# EAGLE schematic TT_PulseGen_V1.0 (EAGLE 7.6.0)
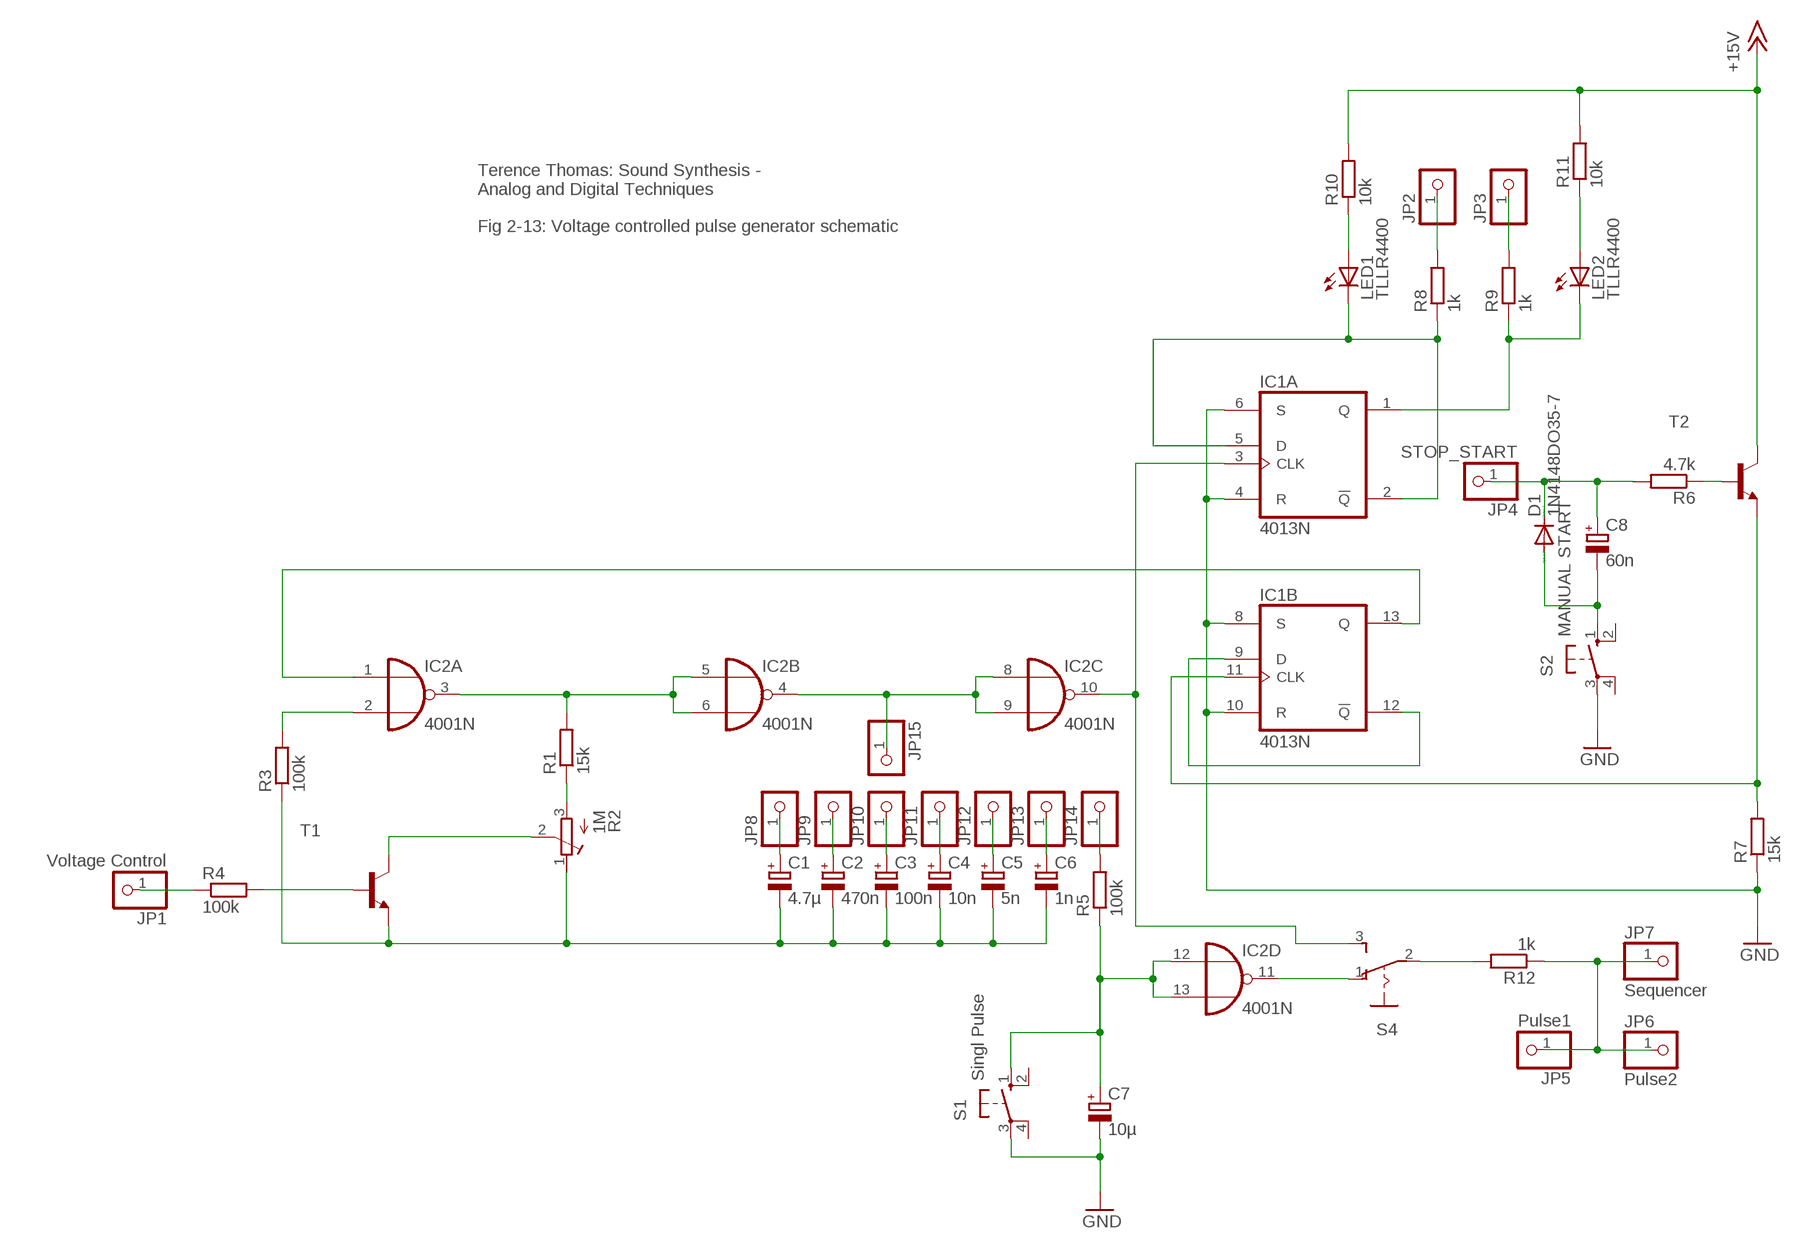
[diagram p0: schematic, sheet 1]

## Parts
C1  4.7µ  CPOL-EUE2.5-5  [E2,5-5]
C2  470n  CPOL-EUE2.5-5  [E2,5-5]
C3  100n  CPOL-EUE2.5-5  [E2,5-5]
C4  10n  CPOL-EUE2.5-5  [E2,5-5]
C5  5n  CPOL-EUE2.5-5  [E2,5-5]
C6  1n  CPOL-EUE2.5-5  [E2,5-5]
C7  10µ  CPOL-EUE2.5-5  [E2,5-5]
C8  60n  CPOL-EUE2.5-5  [E2,5-5]
D1  1N4148DO35-7  [DO35-7]
IC1  4013N  [DIL14]
IC2  4001N  [DIL14]
JP1  Voltage Control  PINHD-1X1  [1X01]
JP2  PINHD-1X1  [1X01]
JP3  PINHD-1X1  [1X01]
JP4  STOP_START  PINHD-1X1  [1X01]
JP5  Pulse1  PINHD-1X1  [1X01]
JP6  Pulse2  PINHD-1X1  [1X01]
JP7  Sequencer  PINHD-1X1  [1X01]
JP8  PINHD-1X1  [1X01]
JP9  PINHD-1X1  [1X01]
JP10  PINHD-1X1  [1X01]
JP11  PINHD-1X1  [1X01]
JP12  PINHD-1X1  [1X01]
JP13  PINHD-1X1  [1X01]
JP14  PINHD-1X1  [1X01]
JP15  PINHD-1X1  [1X01]
LED1  TLLR4400  [LED3MM]
LED2  TLLR4400  [LED3MM]
R1  15k  R-EU_0204/7  [0204/7]
R2  1M  R-TRIMMT93YA  [RTRIMT93YA]
R3  100k  R-EU_0204/7  [0204/7]
R4  100k  R-EU_0204/7  [0204/7]
R5  100k  R-EU_0204/7  [0204/7]
R6  4.7k  R-EU_0204/7  [0204/7]
R7  15k  R-EU_0204/7  [0204/7]
R8  1k  R-EU_0204/7  [0204/7]
R9  1k  R-EU_0204/7  [0204/7]
R10  10k  R-EU_0204/7  [0204/7]
R11  10k  R-EU_0204/7  [0204/7]
R12  1k  R-EU_0204/7  [0204/7]
S1  Singl Pulse  10-XX  [B3F-10XX]
S2  MANUAL START  10-XX  [B3F-10XX]
S4  255SB  [255SB]
T1  -NPN-TO92-EBC  [TO92-EBC]
T2  -NPN-TO92-EBC  [TO92-EBC]

## Nets
+15V: R10.2 R11.2 T2.C
GND: C7.- IC1.4(A:R) IC1.6(A:S) IC1.8(B:S) IC1.10(B:R) R7.1 S1.3(P) S2.3(P)
N$1: IC2.3(A:O) IC2.5(B:I0) IC2.6(B:I1) R1.2
N$2: IC2.4(B:O) IC2.8(C:I0) IC2.9(C:I1) JP15.1
N$3: C7.+ IC2.12(D:I0) IC2.13(D:I1) R5.1 S1.1(S)
N$4: R1.1 R2.3(A)
N$5: R2.2(S) T1.C
N$6: R4.2 T1.B
N$7: IC2.2(A:I1) R3.2
N$8: C1.- C2.- C3.- C4.- C5.- C6.- R2.1(E) R3.1 T1.E
N$9: IC1.13(B:Q) IC2.1(A:I0)
N$10: JP2.1 R8.2
N$11: JP1.1 R4.1
N$12: IC1.3(A:CLK) IC2.10(C:O) S4.3(S)
N$14: R6.1 T2.B
N$15: C8.+ D1.C JP4.1 R6.2
N$16: C8.- D1.A S2.1(S)
N$17: JP3.1 R9.2
N$18: IC1.9(B:D) IC1.12(B:!Q)
N$19: IC2.11(D:O) S4.1(O)
N$20: LED2.A R11.1
N$21: IC1.1(A:Q) LED2.K(C) R9.1
N$22: IC1.2(A:!Q) IC1.5(A:D) LED1.K(C) R8.1
N$23: LED1.A R10.1
N$24: R12.2 S4.2(P)
N$25: JP5.1 JP6.1 JP7.1 R12.1
N$26: C1.+ JP8.1
N$27: C2.+ JP9.1
N$28: C3.+ JP10.1
N$29: C4.+ JP11.1
N$30: C5.+ JP12.1
N$31: C6.+ JP13.1
N$32: JP14.1 R5.2
N$33: IC1.11(B:CLK) R7.2 T2.E
Unconnected: S1.2(S1) S1.4(P1) S2.2(S1) S2.4(P1)

## Notes on the sheet
- Terence Thomas: Sound Synthesis -
  Analog and Digital Techniques
  
  Fig 2-13: Voltage controlled pulse generator schematic

## Power pins joined to a net without a drawn wire
VDD: IC1.14(P:VDD) IC2.14(P:VDD)
VSS: IC1.7(P:VSS) IC2.7(P:VSS)

## Library data of the parts
C1-C8 = resistor:CPOL-EU: POLARIZED CAPACITOR, European symbol
D1 = diode:1N4148: DIODE high speed (Philips)
IC1 = 40xx:4013: Dual D FLIP FLOP, set/reset
IC2 = 40xx:4001: Quad 2-input NOR
JP1-JP15 = pinhead:PINHD-1X1: PIN HEADER
LED1 LED2 = led:TLLR4400: Low Current (2mA) LED 3 mm Tinted Diffused Package color RED Source: Data sheet <http://www.farnell.com/datasheets/391100.pdf>; MF: VISHAY SEMICONDUCTOR; OC_FARNELL: 1612437
R1 R3-R12 = resistor:R-EU_: RESISTOR, European symbol
R2 = resistor:R-TRIMM: Trimm resistor
S1 S2 = switch-omron:10-XX: OMRON SWITCH; MPN: B3F-1000; OC_FARNELL: 176432; OC_NEWARK: 36M3542
S4 = switch:255SB: SLIDING SWITCH Distributor Buerklin, 11G810
T1 T2 = transistor:*-NPN-: NPN Transistror BF959 corrected 2008.03.06